# EAGLE design JTAG (EAGLE 9.6.2)
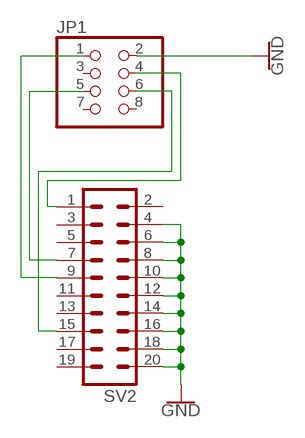
[diagram p0: schematic, sheet 1]

## Parts
JP1  PINHD-2X4  [2X04]
SV2  MA10-2W  [MA10-2W]

## Nets
GND: JP1.2 SV2.4 SV2.6 SV2.8 SV2.10 SV2.12 SV2.14 SV2.16 SV2.18 SV2.20
N$1: JP1.6 SV2.15
N$2: JP1.4 SV2.1
N$3: JP1.5 SV2.7
N$4: JP1.1 SV2.9
Unconnected: JP1.3 JP1.7 JP1.8 SV2.2 SV2.3 SV2.5 SV2.11 SV2.13 SV2.17 SV2.19

## Library data of the parts
JP1 = adafruit:PINHD-2X4: PIN HEADER
SV2 = con-lstb:MA10-2W: PIN HEADER; OC_FARNELL: unknown; OC_NEWARK: unknown

## Board
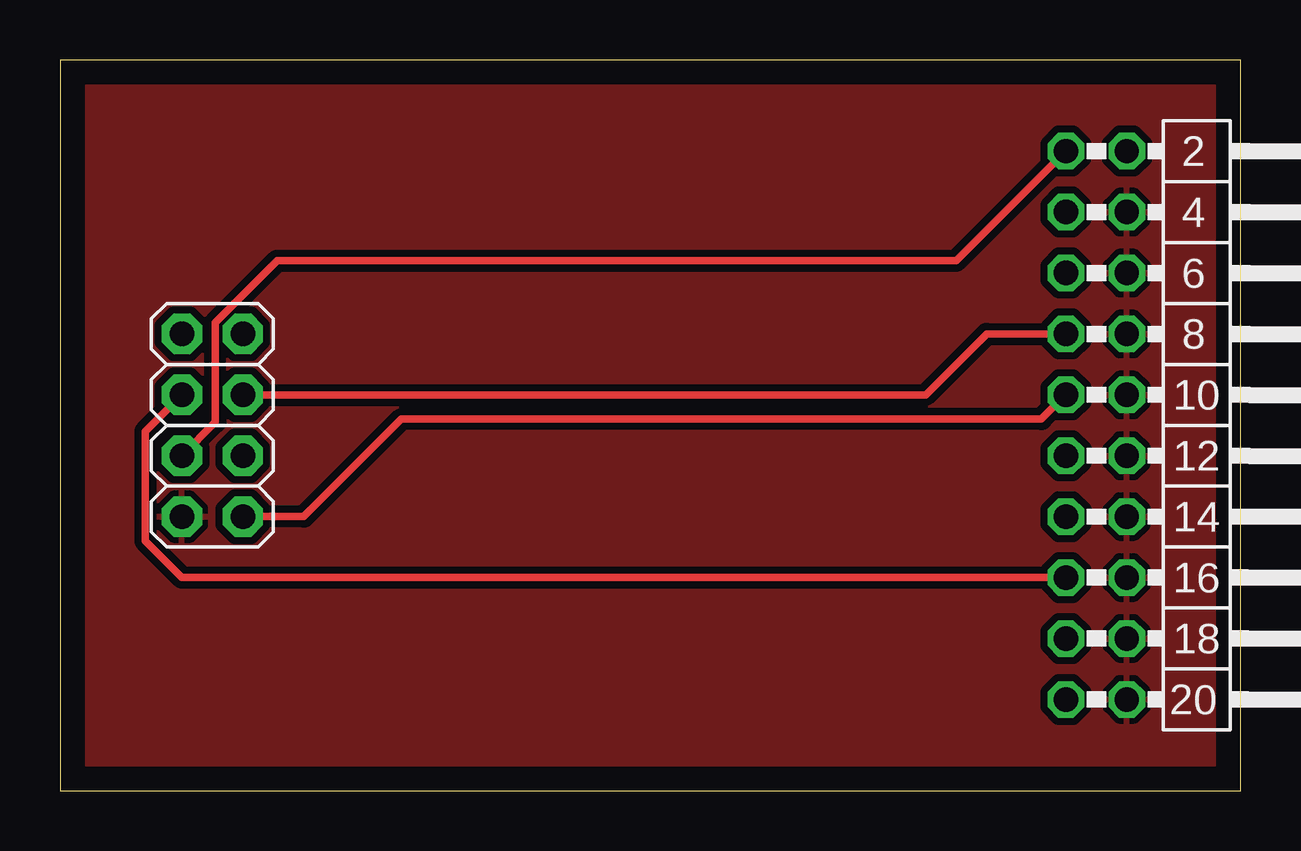
[diagram p1: board, top side]

Size 49.2 x 30.47 mm. Coordinates in mm from the lower left corner, seen from the top.
Outline: 0,0 49.2,0 49.2,30.47 0,30.47 0,0
Copper layers (1*16): Top 0.035mm / dielectric 1.5mm / Bottom 0.035mm
Design rules "default": minimum track width 6mil, minimum drill 0.35mm, track to track 6mil, track to pad 6mil, pad to pad 6mil, via to via 6mil, smd to smd 6mil, copper to edge 40mil, drill to drill 6mil, minimum pad ring 10mil, minimum via ring 8mil, stop-mask expansion 4mil, vias tented up to drill 0mil, thermal gap 10mil

### Footprints (pad centres in the part's own frame; a part is rotated, then mirrored left to right if it is on the bottom)
2X04 = drill 1.016 pad 1.676 octagon: 1 -3.81,-1.27; 2 -3.81,1.27; 3 -1.27,-1.27; 4 -1.27,1.27; 5 1.27,-1.27; 6 1.27,1.27; 7 3.81,-1.27; 8 3.81,1.27
MA10-2W = drill 1.016 octagon: 1 -11.43,-1.27; 2 -11.43,1.27; 3 -8.89,-1.27; 4 -8.89,1.27; 5 -6.35,-1.27; 6 -6.35,1.27; 7 -3.81,-1.27; 8 -3.81,1.27; 9 -1.27,-1.27; 10 -1.27,1.27; 11 1.27,-1.27; 12 1.27,1.27; 13 3.81,-1.27; 14 3.81,1.27; 15 6.35,-1.27; 16 6.35,1.27; 17 8.89,-1.27; 18 8.89,1.27; 19 11.43,-1.27; 20 11.43,1.27

### Placement (x,y rotation side)
JP1  6.35,15.24 90 top
SV2  43.18,15.24 270 top

### Tracks (layer width: path | path; a pad name or v marks a point on that pad's centre or on a via)
GND
  pour Top (isolate 0.305): 0.51,29.72 0.51,0.25 48.77,0.25 48.77,29.72
N$1
  Top 0.305: JP1.6 3.56,14.99 3.56,10.41 5.08,8.89 SV2.15
N$2
  Top 0.305: JP1.4 6.48,15.37 6.48,19.52 9.05,22.1 37.34,22.1 SV2.1
N$3
  Top 0.305: JP1.5 36.07,16.51 38.61,19.05 SV2.7
N$4
  Top 0.305: SV2.9 40.89,15.49 14.22,15.49 10.16,11.43 JP1.1